# Altium schematic sheet GeneratedSystem-05.SchDoc
size 150 x 80 mm
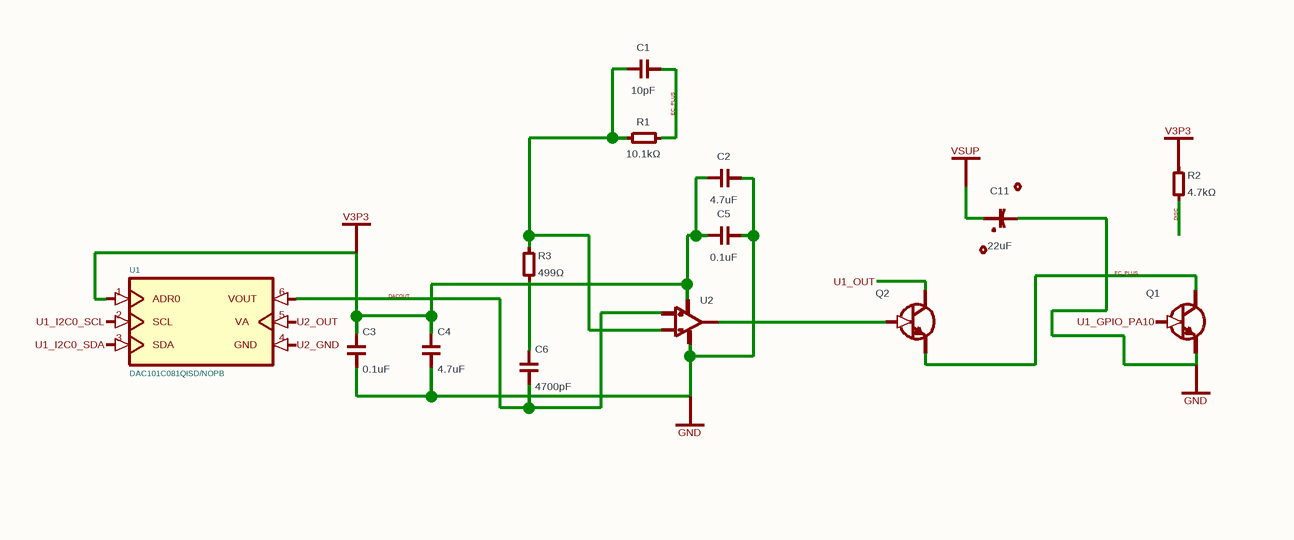
[diagram p0: GeneratedSystem-05.SchDoc]

## Parts
C1  10pF
C2  4.7uF
C3  0.1uF
C4  4.7uF
C5  0.1uF
C6  4700pF
C11  22uF
Q1  (no value)
Q2  (no value)
R1  10.1kΩ
R2  4.7kΩ
R3  499Ω
U1  (no value)
U2  (no value)

## Nets
GND: C2.2(neg) C3.2(cathode) C4.2(cathode) C5.2(neg) C11.2(neg) Q1.3(emitter) U2.3(V-)
V3P3: C2.1(pos) C3.1(anode) C4.1(anode) C5.1(pos) R2.1(anode) U1.1(ADR0) U2.5(V+)
VSUP: C11.1(pos)
U1_GPIO_PA10: Q1.2(base)
U1_I2C0_SCL: U1.2(SCL)
U1_I2C0_SDA: U1.3(SDA)
U1_OUT: Q2.1(collector)
U2_GND: U1.4(GND)
U2_OUT: U1.5(VA)
NetC1_1: C1.1(pos) R1.2(cathode)
NetC1_2: C1.2(neg) R1.1(anode) R3.1(anode) U2.2(inp2)
NetC6_1: C6.1(anode) R3.2(cathode)
NetC6_2: C6.2(cathode) U1.6(VOUT) U2.1(inp1)
NetQ1_1: Q1.1(collector) Q2.3(emitter)
NetQ2_2: Q2.2(base) U2.4(out)

Not connected (* = marked no-connect by the designer): R2 2(cathode)

## Notes on the sheet
- EC_PLUS
- DACOUT
- (near R2) DISC
- (in symbol U1) DAC101C081QISD/NOPB

## Library data of the parts
C1 = capacitor_left
C2 C5 = capacitor_right
C3 C4 C6 = capacitor_down
C11 = capacitor_polarized_right
Q1 Q2 = npn_bipolar_transistor_down
R1 = boxresistor_right
R2 R3 = boxresistor_down
U1 = U1
U2 = opamp_with_power_right